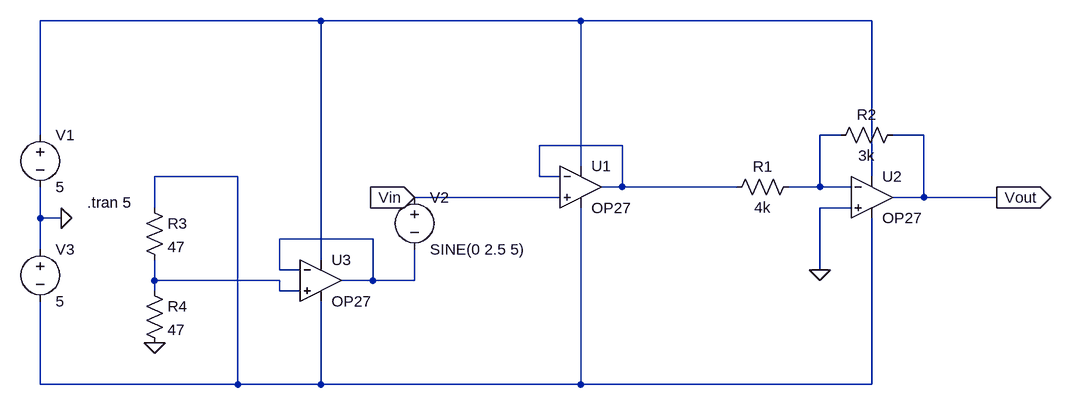
[diagram p0: schematic Input.asc]
Input.asc, the LTspice schematic file:
Version 4
SHEET 1 1248 680
WIRE -176 -96 -608 -96
WIRE 224 -96 -176 -96
WIRE 672 -96 224 -96
WIRE -608 80 -608 -96
WIRE 624 80 592 80
WIRE 752 80 704 80
WIRE 288 96 160 96
WIRE 224 128 224 -96
WIRE -304 144 -432 144
WIRE 160 144 160 96
WIRE 192 144 160 144
WIRE 672 144 672 -96
WIRE 288 160 288 96
WIRE 288 160 256 160
WIRE 464 160 288 160
WIRE 592 160 592 80
WIRE 592 160 544 160
WIRE 640 160 592 160
WIRE 192 176 -32 176
WIRE 752 176 752 80
WIRE 752 176 704 176
WIRE 864 176 752 176
WIRE -432 192 -432 144
WIRE 640 192 592 192
WIRE -608 208 -608 160
WIRE -576 208 -608 208
WIRE -96 240 -240 240
WIRE -608 256 -608 208
WIRE -176 272 -176 -96
WIRE -240 288 -240 240
WIRE -208 288 -240 288
WIRE 592 288 592 192
WIRE -432 304 -432 272
WIRE -240 304 -432 304
WIRE -96 304 -96 240
WIRE -96 304 -144 304
WIRE -32 304 -32 256
WIRE -32 304 -96 304
WIRE -432 320 -432 304
WIRE -240 320 -240 304
WIRE -208 320 -240 320
WIRE -608 464 -608 336
WIRE -304 464 -304 144
WIRE -304 464 -608 464
WIRE -176 464 -176 336
WIRE -176 464 -304 464
WIRE 224 464 224 192
WIRE 224 464 -176 464
WIRE 672 464 672 208
WIRE 672 464 224 464
FLAG -32 176 Vin
IOPIN -32 176 In
FLAG 864 176 Vout
IOPIN 864 176 Out
FLAG -576 208 0
FLAG -432 400 0
FLAG 592 288 0
SYMBOL OpAmps\\OP27 224 96 R0
SYMATTR InstName U1
SYMBOL voltage -608 64 R0
WINDOW 123 0 0 Left 0
WINDOW 39 0 0 Left 0
SYMATTR InstName V1
SYMATTR Value 5
SYMBOL voltage -32 160 R0
WINDOW 123 0 0 Left 0
WINDOW 39 0 0 Left 0
SYMATTR InstName V2
SYMATTR Value SINE(0 2.5 5)
SYMBOL voltage -608 240 R0
WINDOW 123 0 0 Left 0
WINDOW 39 0 0 Left 0
SYMATTR InstName V3
SYMATTR Value 5
SYMBOL OpAmps\\OP27 672 112 R0
SYMATTR InstName U2
SYMBOL res 560 144 R90
WINDOW 0 0 56 VBottom 2
WINDOW 3 32 56 VTop 2
SYMATTR InstName R1
SYMATTR Value 4k
SYMBOL res 720 64 R90
WINDOW 0 0 56 VBottom 2
WINDOW 3 32 56 VTop 2
SYMATTR InstName R2
SYMATTR Value 3k
SYMBOL res -448 176 R0
SYMATTR InstName R3
SYMATTR Value 47
SYMBOL res -448 304 R0
SYMATTR InstName R4
SYMATTR Value 47
SYMBOL OpAmps\\OP27 -176 240 R0
SYMATTR InstName U3
TEXT -536 184 Left 2 !.tran 5

The netlist it stands for:
* Input.asc
XU1 Vin N003 N001 N004 N003 OP27  ; pins In+ In- V+ V- OUT
V1 N001 0 5
V2 Vin N005 SINE(0 2.5 5)
V3 0 N004 5
XU2 0 N002 N001 N004 Vout OP27  ; pins In+ In- V+ V- OUT
R1 N002 N003 4k
R2 Vout N002 3k
R3 N004 N006 47
R4 N006 0 47
XU3 N006 N005 N001 N004 N005 OP27  ; pins In+ In- V+ V- OUT
.tran 5
.lib ADI.lib
.backanno
.end